# EAGLE design 612_jetracer_328_209 (EAGLE 9.6.2)
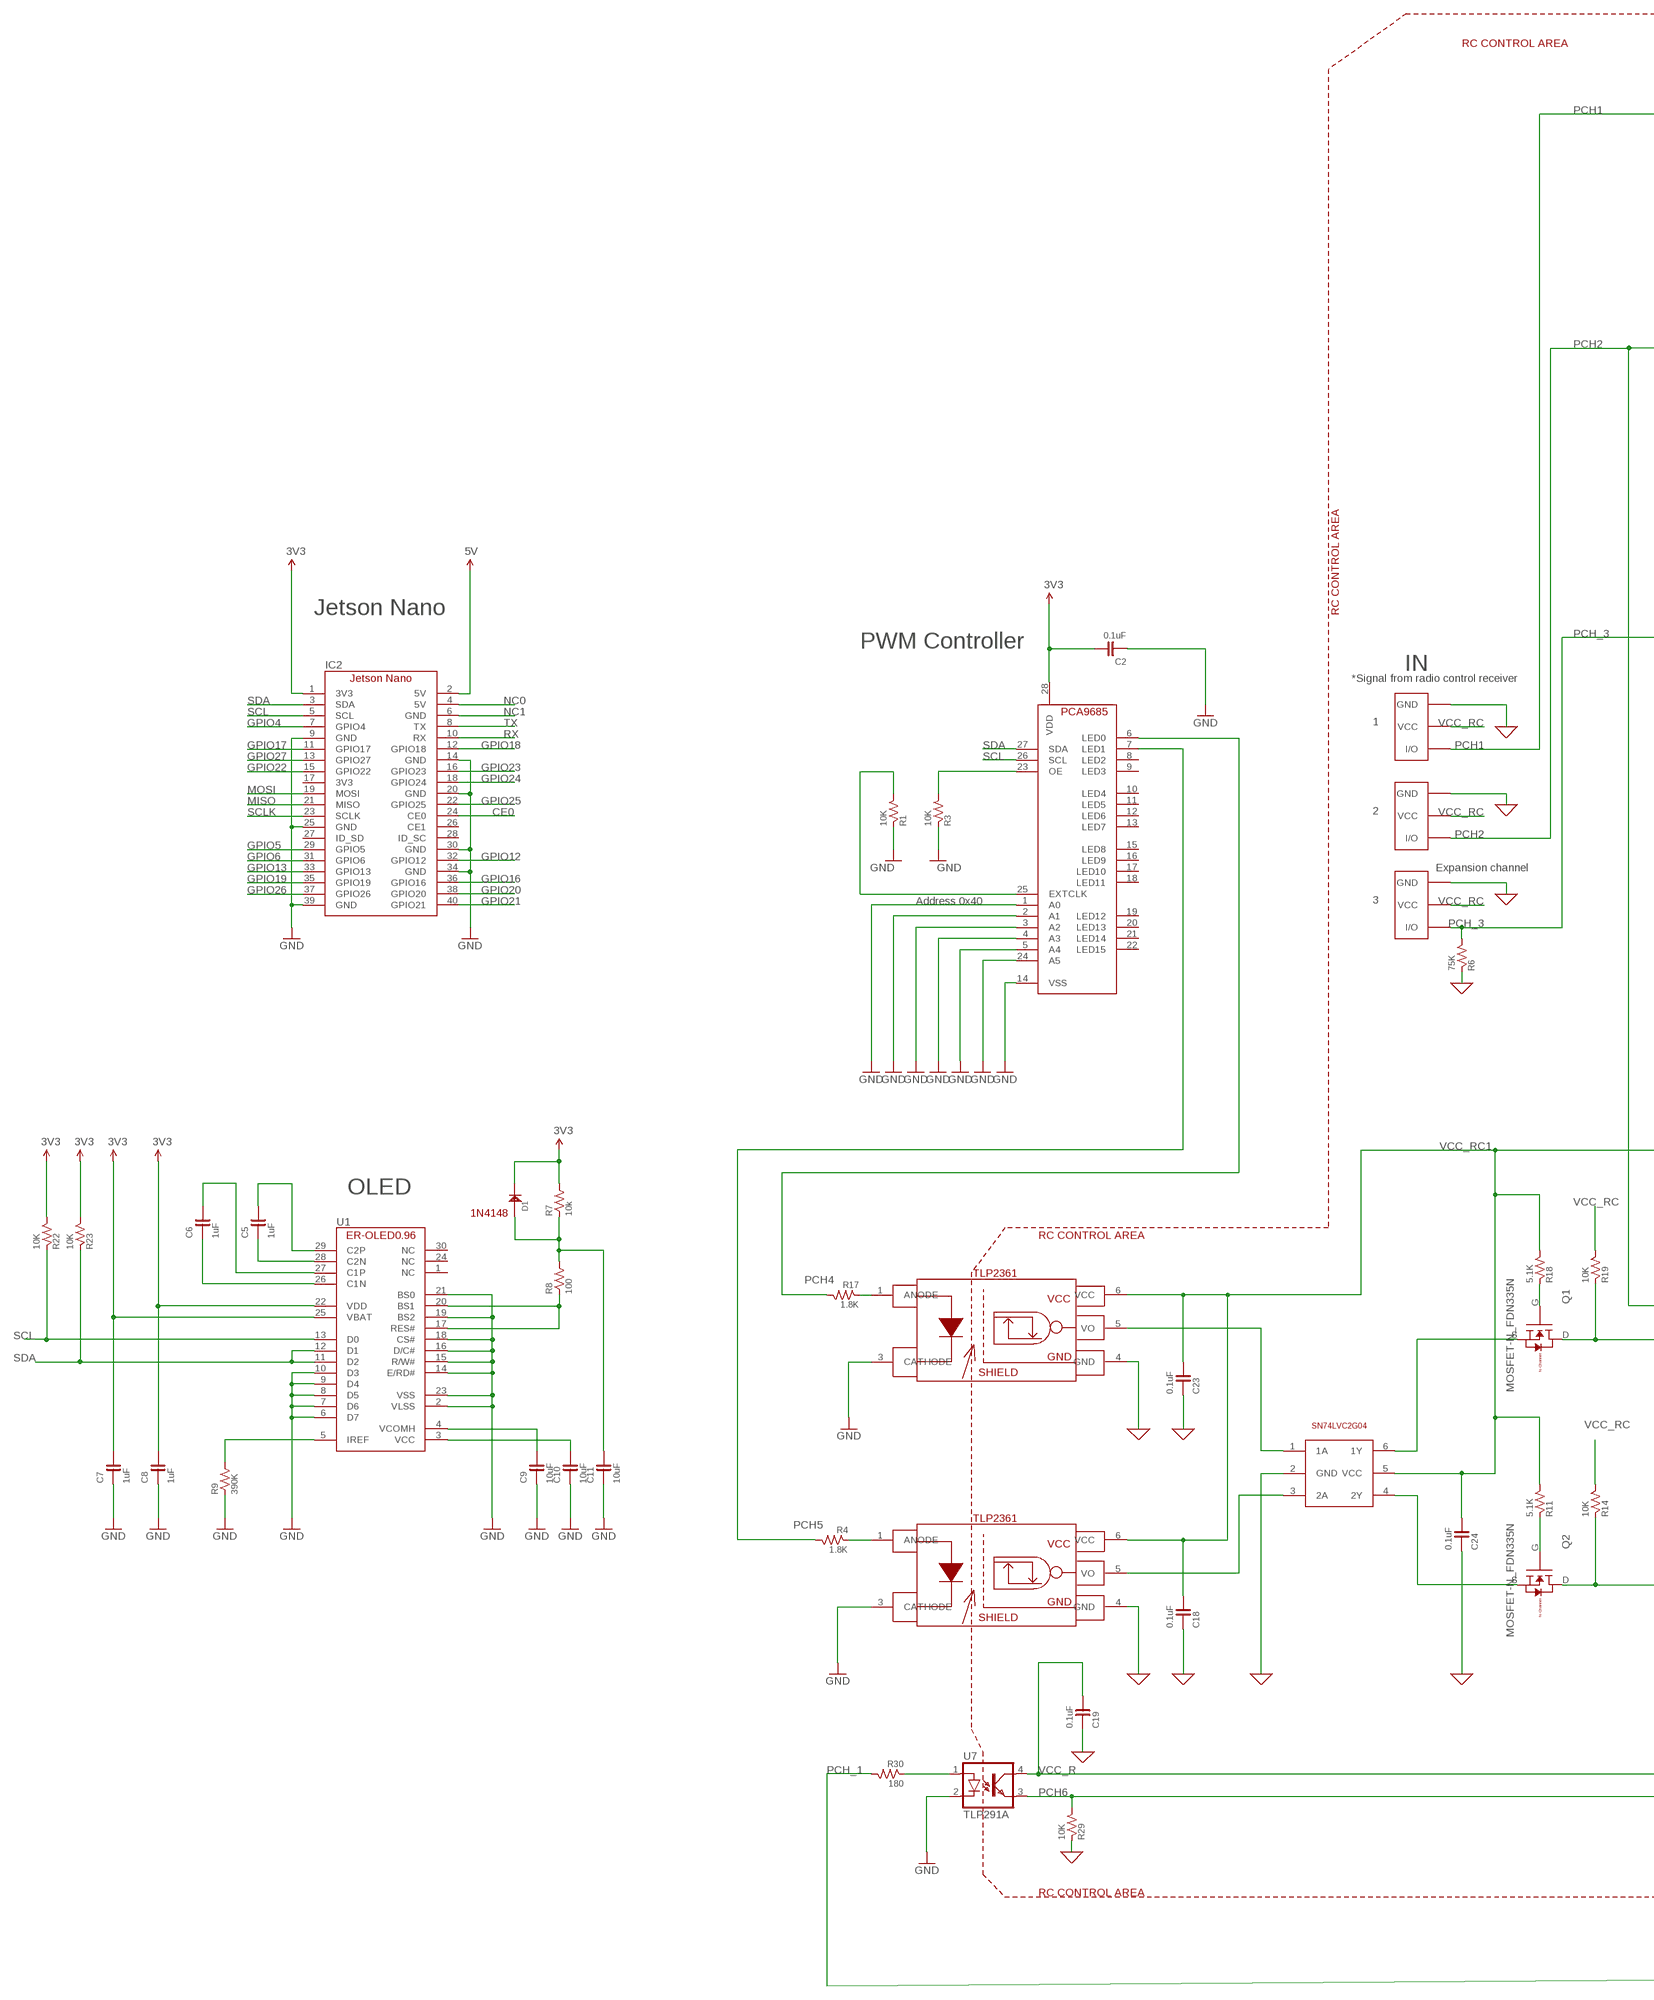
[diagram p0: schematic, sheet 1, part 1 of 3]
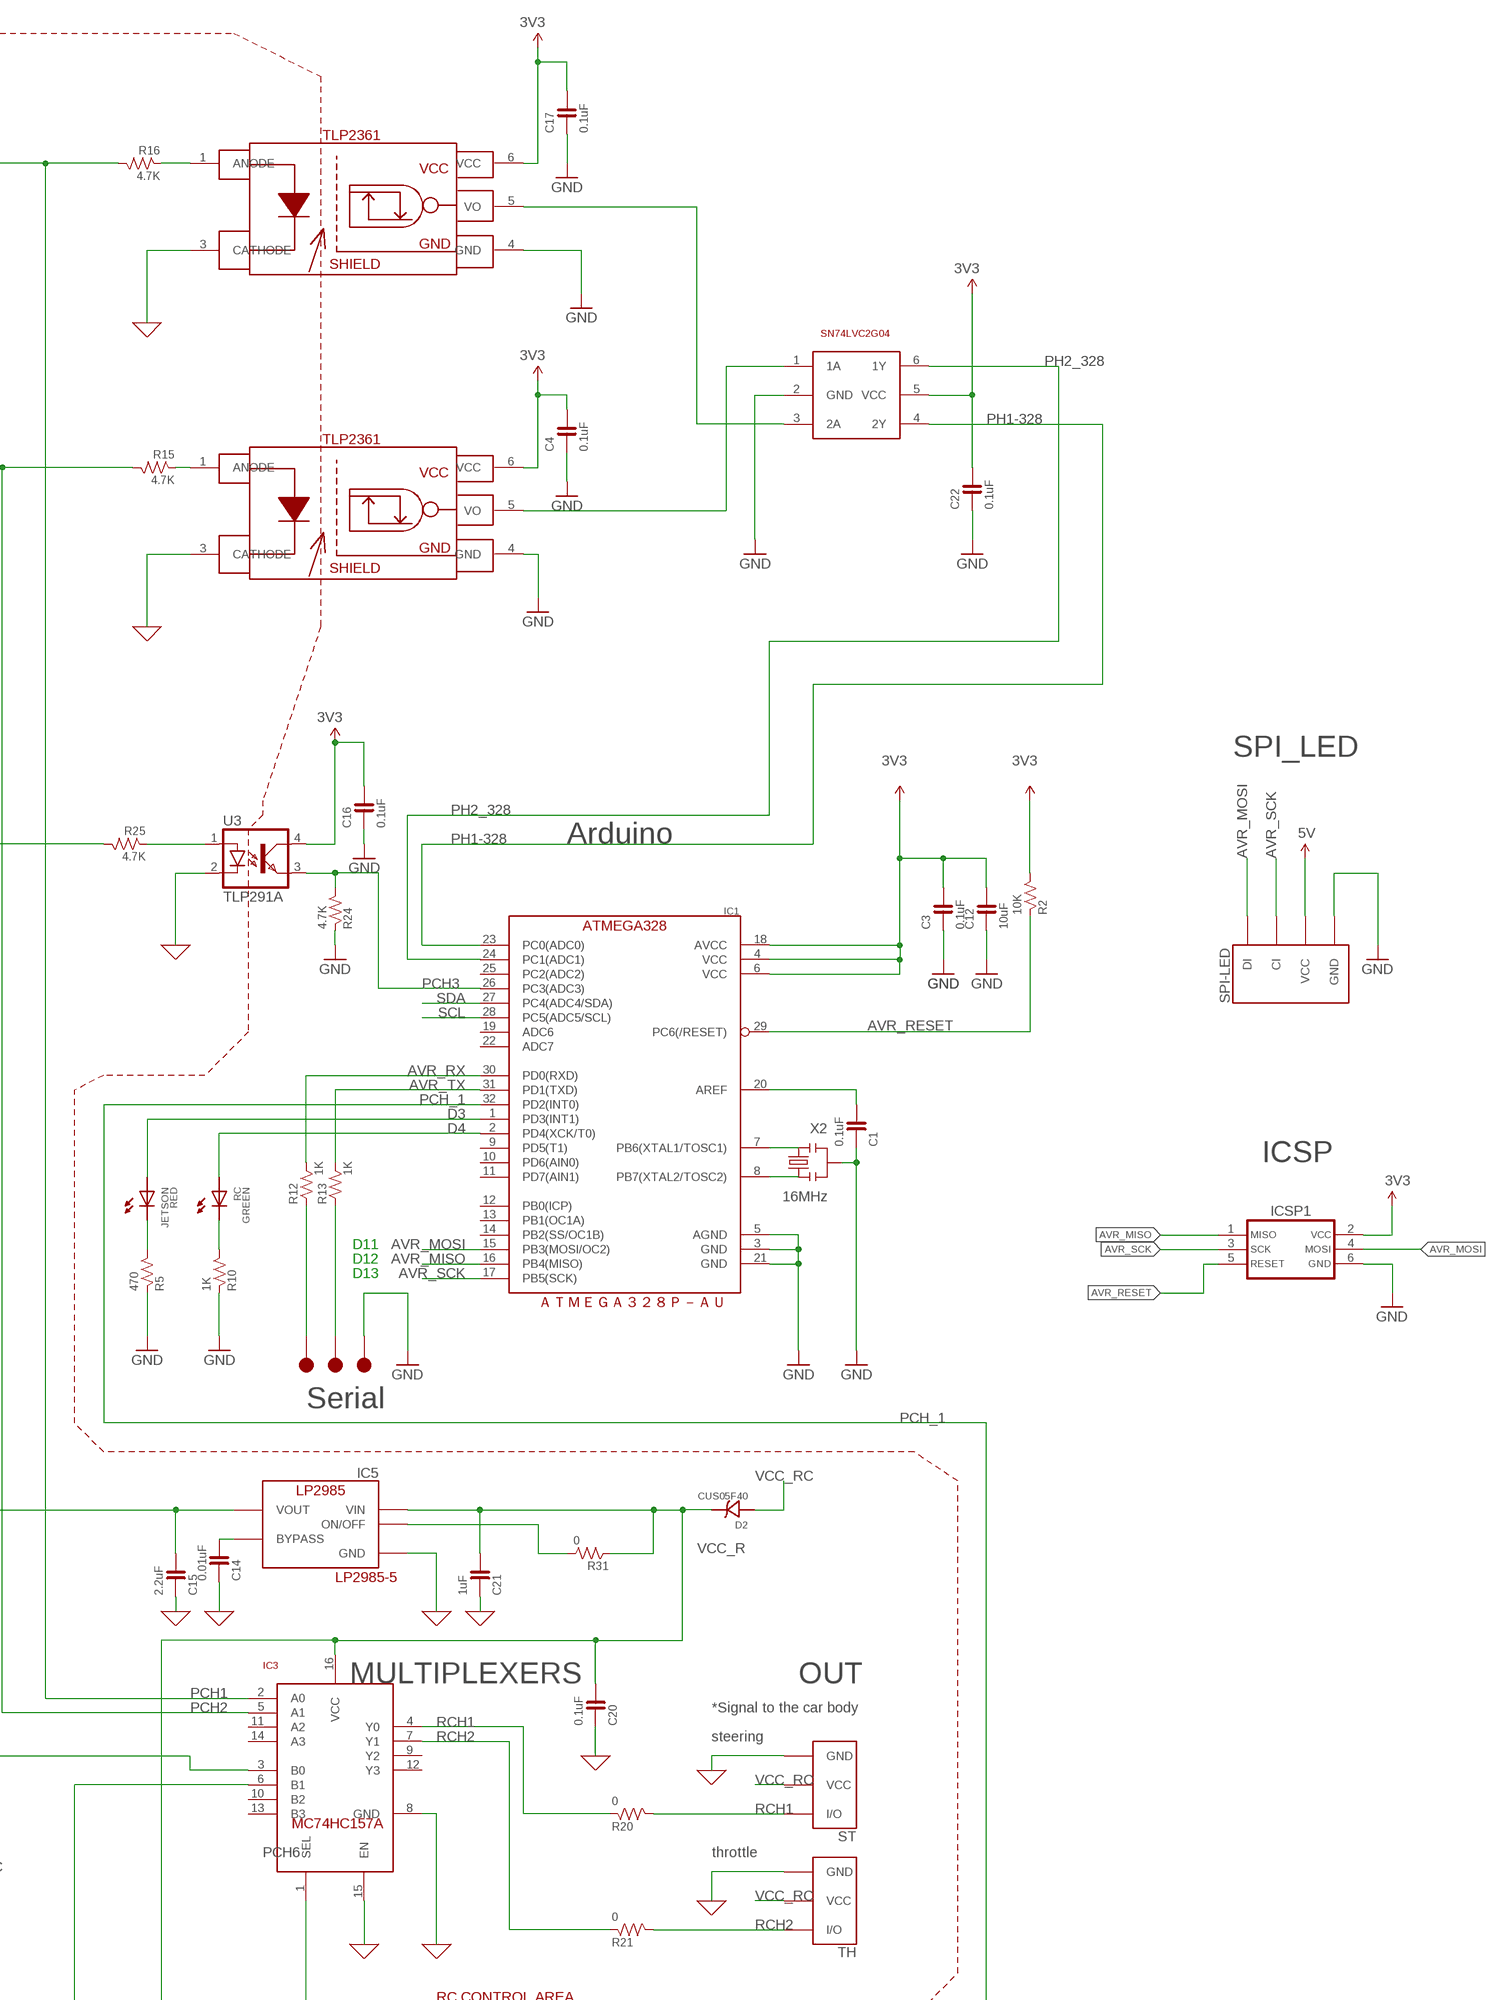
[diagram p1: schematic, sheet 1, part 2 of 3]
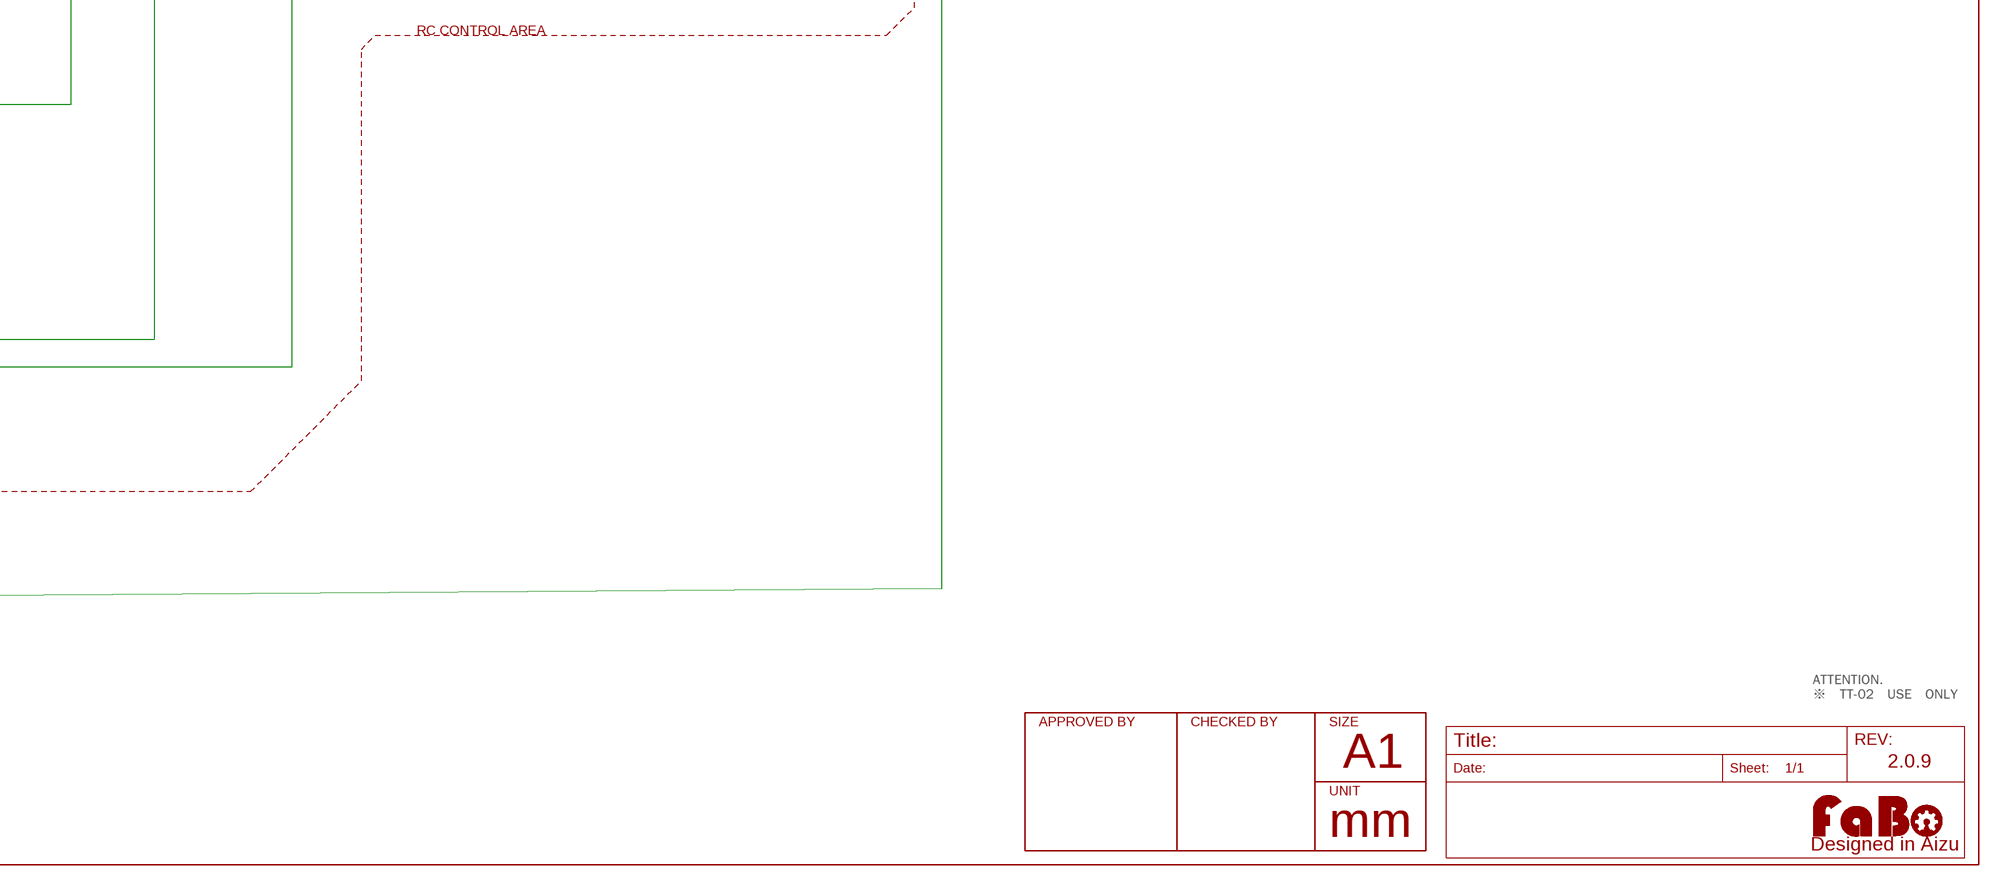
[diagram p2: schematic, sheet 1, part 3 of 3]

## Parts
1  FABO_BRICK_3PIN-HEADER  [FABO_BRICK_3PIN_HEADER]
2  FABO_BRICK_3PIN-HEADER  [FABO_BRICK_3PIN_HEADER]
3  FABO_BRICK_3PIN-HEADER  [FABO_BRICK_3PIN_HEADER]
C1  0.1uF  CAPACITOR-0603  [0603]
C2  0.1uF  CAPACITOR-0603  [0603]
C3  0.1uF  CAPACITOR-0603-BOTTOM  [0603-BOTTOM]
C4  0.1uF  CAPACITOR-0603-BOTTOM  [0603-BOTTOM]
C5  1uF  CAPACITOR-0603-BOTTOM  [0603-BOTTOM]
C6  1uF  CAPACITOR-0603-BOTTOM  [0603-BOTTOM]
C7  1uF  CAPACITOR-0603-BOTTOM  [0603-BOTTOM]
C8  1uF  CAPACITOR-0603-BOTTOM  [0603-BOTTOM]
C9  10uF  CAPACITOR-0603-BOTTOM  [0603-BOTTOM]
C10  10uF  CAPACITOR-0603-BOTTOM  [0603-BOTTOM]
C11  10uF  CAPACITOR-0603-BOTTOM  [0603-BOTTOM]
C12  10uF  CAPACITOR-0603-BOTTOM  [0603-BOTTOM]
C14  0.01uF  CAPACITOR-0603  [0603]
C15  2.2uF  CAPACITOR-0603  [0603]
C16  0.1uF  CAPACITOR-0603-BOTTOM  [0603-BOTTOM]
C17  0.1uF  CAPACITOR-0603_NARROW  [0603-NARROW]
C18  0.1uF  CAPACITOR-0603  [0603]
C19  0.1uF  CAPACITOR-0603  [0603]
C20  0.1uF  CAPACITOR-0603  [0603]
C21  1uF  CAPACITOR-0603  [0603]
C22  0.1uF  CAPACITOR-0603-BOTTOM  [0603-BOTTOM]
C23  0.1uF  CAPACITOR-0603  [0603]
C24  0.1uF  CAPACITOR-0603  [0603]
D1  1N4148  [1N4148W]
D2  CUS05F40  [CUS05F40]
IC1  ATMEGA328P-AU  [TQFP-32]
IC2  JETSON_NANO_NOBORDER  [JETSON_NANO_NOBOARDER]
IC3  MULTIPLEXERSMC74HC157A  [TSSOP-16]
IC4  PCA9685_BOTTOM  [PCA9685_BOTTOM]
IC5  LP2985-33DBV  [SOT-23-5]
ICSP1  ICSP_AVR-TC_NOHOLE  [TC2030]
JETSON  GREEN  LED-0603  [0603]
Q1  MOSFET-N_FDN335N  [SUPERSOT-3]
Q2  MOSFET-N_FDN335N  [SUPERSOT-3]
R1  10K  RESISTOR-0603  [0603]
R2  10K  RESISTOR-0603  [0603]
R3  10K  RESISTOR-0603  [0603]
R4  1.8K  RESISTOR-0603  [0603]
R5  470  RESISTOR-0603  [0603]
R6  75K  RESISTOR-0603  [0603]
R7  10k  RESISTOR-0603-BOTTOM  [0603-BOTTOM]
R8  100  RESISTOR-0603-BOTTOM  [0603-BOTTOM]
R9  390K  RESISTOR-0603-BOTTOM  [0603-BOTTOM]
R10  1K  RESISTOR-0603  [0603]
R11  5.1K  RESISTOR-0603  [0603]
R12  1K  RESISTOR-0603  [0603]
R13  1K  RESISTOR-0603  [0603]
R14  10K  RESISTOR-0603  [0603]
R15  4.7K  RESISTOR-0603  [0603]
R16  4.7K  RESISTOR-0603  [0603]
R17  1.8K  RESISTOR-0603  [0603]
R18  5.1K  RESISTOR-0603  [0603]
R19  10K  RESISTOR-0603  [0603]
R20  0  RESISTOR-0603  [0603]
R21  0  RESISTOR-0603  [0603]
R22  10K  RESISTOR-0603  [0603]
R23  10K  RESISTOR-0603  [0603]
R24  4.7K  RESISTOR-0603  [0603]
R25  4.7K  RESISTOR-0603  [0603]
R29  10K  RESISTOR-0603  [0603]
R30  180  RESISTOR-0603  [0603]
R31  0  RESISTOR-0603  [0603]
RC  RED  LED-0603  [0603]
SPI-LED  FABO-SPI-LED-B04B  [SPI-B04B-PASK-1]
ST  FABO_BRICK_3PIN-HEADER  [FABO_BRICK_3PIN_HEADER]
T5  SN74LVC2G04  [SOT-23-6]
T6  SN74LVC2G04  [SOT-23-6]
TH  FABO_BRICK_3PIN-HEADER  [FABO_BRICK_3PIN_HEADER]
TP1  TP-15  [TP-15]
TP2  TP-15  [TP-15]
TP3  TP-15  [TP-15]
U1  ER-OLED0.96-1ER-CON30HT-1  [ER-CON30HT-1]
U3  TLP291A  [11-3C1]
U7  TLP291A  [11-3C1]
U8  TLP2361  [TLP2361]
U9  TLP2361  [TLP2361]
U10  TLP2361  [TLP2361]
U11  TLP2361  [TLP2361]
U$5  LOGO_FABO-M  [LOGO_FABO_MS]
X2  16MHz  RESONATOR  [CSTNE_V_C]

## Nets
0: 1.GND 2.GND 3.GND C14.1 C15.1 C18.1 C19.1 C20.1 C21.1 C23.1 C24.1 IC3.8(GND) IC3.15(EN) IC5.2(GND) R6.1 R29.1 ST.GND T6.2(GND) TH.GND U3.2(C) U8.3(CATHODE) U9.3(CATHODE) U10.4(GND) U11.4(GND) ; supply symbol labelled GND
3V3: C2.2 C3.2 C4.2 C7.2 C8.2 C12.2 C16.2 C17.2 C22.2 D1.CATHODE IC1.4(VCC) IC1.6(VCC) IC1.18(AVCC) IC2.1(3V3) IC4.28(VDD) ICSP1.2 R2.2 R7.2 R22.2 R23.2 T5.5(VCC) U1.22(VDD) U1.25(VBAT) U3.4(COL) U8.6(VCC) U9.6(VCC)
5V: IC2.2(5V) SPI-LED.VCC
AVR_MISO: IC1.16(PB4(MISO)) ICSP1.1
AVR_MOSI: IC1.15(PB3(MOSI/OC2)) ICSP1.4 SPI-LED.DI
AVR_RESET: IC1.29(PC6(/RESET)) ICSP1.5 R2.1
AVR_RX: IC1.30(PD0(RXD)) R12.2
AVR_SCK: IC1.17(PB5(SCK)) ICSP1.3 SPI-LED.CI
AVR_TX: IC1.31(PD1(TXD)) R13.2
CE0: IC2.24(CE0)
D3: IC1.1(PD3(INT1)) RC.ANODE
D4: IC1.2(PD4(XCK/T0)) JETSON.ANODE
GND: C1.1 C2.1 C3.1 C4.1 C7.1 C8.1 C9.1 C10.1 C11.1 C12.1 C16.1 C17.1 C22.1 IC1.3(GND) IC1.5(AGND) IC1.21(GND) IC2.9(GND) IC2.14(GND) IC2.20(GND) IC2.25(GND) IC2.30(GND) IC2.34(GND) IC2.39(GND) IC4.1(A0) IC4.2(A1) IC4.3(A2) IC4.4(A3) IC4.5(A4) IC4.14(VSS) IC4.24(A5) ICSP1.6 R1.1 R3.1 R5.1 R9.1 R10.1 R24.1 SPI-LED.GND T5.2(GND) TP3.1 U1.2(VLSS) U1.6(D7) U1.7(D6) U1.8(D5) U1.9(D4) U1.10(D3) U1.14(E/RD#) U1.15(R/W#) U1.16(D/C#) U1.18(CS#) U1.19(BS2) U1.21(BS0) U1.23(VSS) U7.2(C) U8.4(GND) U9.4(GND) U10.3(CATHODE) U11.3(CATHODE) X2.2
GPIO4: IC2.7(GPIO4)
GPIO5: IC2.29(GPIO5)
GPIO6: IC2.31(GPIO6)
GPIO12: IC2.32(GPIO12)
GPIO13: IC2.33(GPIO13)
GPIO16: IC2.36(GPIO16)
GPIO17: IC2.11(GPIO17)
GPIO18: IC2.12(GPIO18)
GPIO19: IC2.35(GPIO19)
GPIO20: IC2.38(GPIO20)
GPIO21: IC2.40(GPIO21)
GPIO22: IC2.15(GPIO22)
GPIO23: IC2.16(GPIO23)
GPIO24: IC2.18(GPIO24)
GPIO25: IC2.22(GPIO25)
GPIO26: IC2.37(GPIO26)
GPIO27: IC2.13(GPIO27)
MISO: IC2.21(MISO)
MOSI: IC2.19(MOSI)
N$2: R4.1 U11.1(ANODE)
N$3: IC3.3(B0) Q1.D R19.1
N$4: C1.2 IC1.20(AREF)
N$5: IC1.8(PB7(XTAL2/TOSC2)) X2.3
N$6: R12.1 TP1.1
N$7: IC4.23(OE) R3.2
N$8: IC4.25(EXTCLK) R1.2
N$9: R15.1 U9.1(ANODE)
N$10: T5.1(1A) U9.5(VO)
N$11: T5.3(2A) U8.5(VO)
N$12: R16.1 U8.1(ANODE)
N$13: R17.1 U10.1(ANODE)
N$14: T6.1(1A) U10.5(VO)
N$15: IC1.7(PB6(XTAL1/TOSC1)) X2.1
N$16: C6.2 U1.27(C1P)
N$17: R13.1 TP2.1
N$18: T6.3(2A) U11.5(VO)
N$19: R5.2 RC.CATHODE
N$20: JETSON.CATHODE R10.2
N$21: C6.1 U1.26(C1N)
N$22: C5.1 U1.28(C2N)
N$23: C5.2 U1.29(C2P)
N$24: R9.2 U1.5(IREF)
N$25: C9.2 U1.4(VCOMH)
N$26: C10.2 U1.3(VCC)
N$27: R8.1 U1.17(RES#) U1.20(BS1)
N$28: C11.2 D1.ANODE R7.1 R8.2
N$31: C14.2 IC5.4(BYPASS)
N$32: IC5.3(ON/OFF) R31.2
N$34: Q2.S T6.4(2Y)
N$35: R21.2 TH.I/O
N$36: R20.2 ST.I/O
N$37: Q1.S T6.6(1Y)
N$38: R25.1 U3.1(A)
N$39: Q2.G R11.1
N$40: Q1.G R18.1
N$42: IC3.6(B1) Q2.D R14.1
N$43: R30.1 U7.1(A)
NC0: IC2.4(5V)
NC1: IC2.6(GND)
PCH1: 1.I/O IC3.2(A0) R16.2
PCH2: 2.I/O IC3.5(A1) R15.2
PCH3: IC1.26(PC3(ADC3)) R24.2 U3.3(EMI)
PCH4: IC4.6(LED0) R17.2
PCH5: IC4.7(LED1) R4.2
PCH6: IC3.1(SEL) R29.2 U7.3(EMI)
PCH_1: IC1.32(PD2(INT0)) R30.2
PCH_3: 3.I/O R6.2 R25.2
PH1-328: IC1.23(PC0(ADC0)) T5.4(2Y)
PH2_328: IC1.24(PC1(ADC1)) T5.6(1Y)
RCH1: IC3.4(Y0) R20.1
RCH2: IC3.7(Y1) R21.1
RX: IC2.10(RX)
SCL: IC1.28(PC5(ADC5/SCL)) IC2.5(SCL) IC4.26(SCL) R22.1 U1.13(D0)
SCLK: IC2.23(SCLK)
SDA: IC1.27(PC4(ADC4/SDA)) IC2.3(SDA) IC4.27(SDA) R23.1 U1.11(D2) U1.12(D1)
TX: IC2.8(TX)
VCC_R: C19.2 C20.2 C21.2 D2.C(CATHODE) IC3.16(VCC) IC5.1(VIN) R31.1 U7.4(COL)
VCC_RC: 1.VCC 2.VCC 3.VCC D2.A(ANODE) R14.2 R19.2 ST.VCC TH.VCC
VCC_RC1: C15.2 C18.2 C23.2 C24.2 IC5.5(VOUT) R11.2 R18.2 T6.5(VCC) U10.6(VCC) U11.6(VCC)
Unconnected: IC1.9(PD5(T1)) IC1.10(PD6(AIN0)) IC1.11(PD7(AIN1)) IC1.12(PB0(ICP)) IC1.13(PB1(OC1A)) IC1.14(PB2(SS/OC1B)) IC1.19(ADC6) IC1.22(ADC7) IC1.25(PC2(ADC2)) IC2.17(3V3) IC2.26(CE1) IC2.27(ID_SD) IC2.28(ID_SC) IC3.9(Y2) IC3.10(B2) IC3.11(A2) IC3.12(Y3) IC3.13(B3) IC3.14(A3) IC4.8(LED2) IC4.9(LED3) IC4.10(LED4) IC4.11(LED5) IC4.12(LED6) IC4.13(LED7) IC4.15(LED8) IC4.16(LED9) IC4.17(LED10) IC4.18(LED11) IC4.19(LED12) IC4.20(LED13) IC4.21(LED14) IC4.22(LED15) U1.1(NC) U1.24(NC) U1.30(NC)

## Notes on the sheet
- RC CONTROL AREA
- SPI_LED
- Jetson Nano | RC CONTROL AREA
- Arduino
- PWM Controller
- IN
- *Signal from radio control receiver
- Expansion channel
- ICSP
- Address 0x40
- D11
- D12
- D13
- ＡＴＭＥＧＡ３２８Ｐ－ＡＵ
- Serial
- OLED
- LP2985-5
- 1N4148
- RC CONTROL AREA
- MULTIPLEXERS | OUT
- *Signal to the car body
- steering
- MC74HC157A
- throttle
- RC CONTROL AREA
- RC CONTROL AREA
- ATTENTION.
  ※　TT-02　USE　ONLY
- 2.0.9

## Library data of the parts
1-3 ST TH = FaBo-Template:FABO_BRICK_3PIN: FaBo Brick 3pin
C1-C12 C14-C17 C20-C22 = FaBo-Capacitor:CAPACITOR: CAPACITOR
C18 C19 C23 C24 = FaBo-Capacitor:CAPACITOR: CAPACITOR; SPICEPREFIX: C
D1 = FaBo-Diode:1N4148
D2 = FaBo-Diode:CUS05F40
IC1 = component:ATMEGA328
IC2 = FaBo-Boards:JETSON_NANO
IC3 = FaBo-Multiplexers:MULTIPLEXERS
IC4 = FaBo-Motor:PCA9685
IC5 = FaBo-Supply:LP2985: LP2985
ICSP1 = component:ICSP_AVR
JETSON RC = FaBo-LED:LED
Q1 Q2 = FaBo-Mosfet:MOSFET-N
R1-R25 R29-R31 = FaBo-Resistors:RESISTOR: RESISTOR
SPI-LED = FaBo-Connetor:FABO-SPI-LED
T5 T6 = FaBo-Transistor:SN74LVC2G04
TP1-TP3 = FaBo-Supply:TP
U1 = FaBo-Display:ER-OLED0.96-1
U3 U7 = FaBo_Photocoupler:TLP291A
U8-U11 = FaBo-etc:TLP2361
U$5 = FaBo-Logo:LOGO_FABO
X2 = component:RESONATOR

## Board
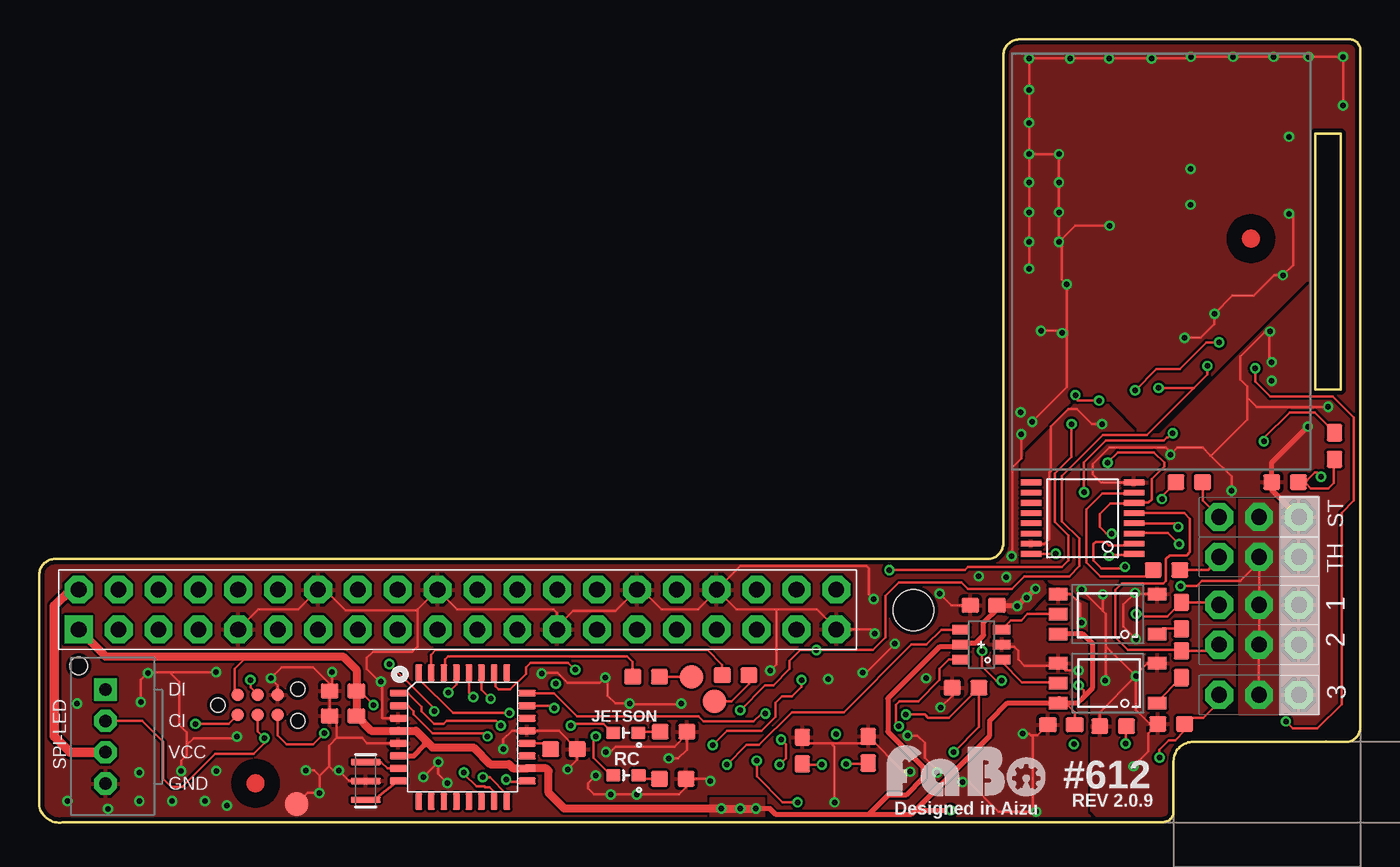
[diagram p3: board, top side]
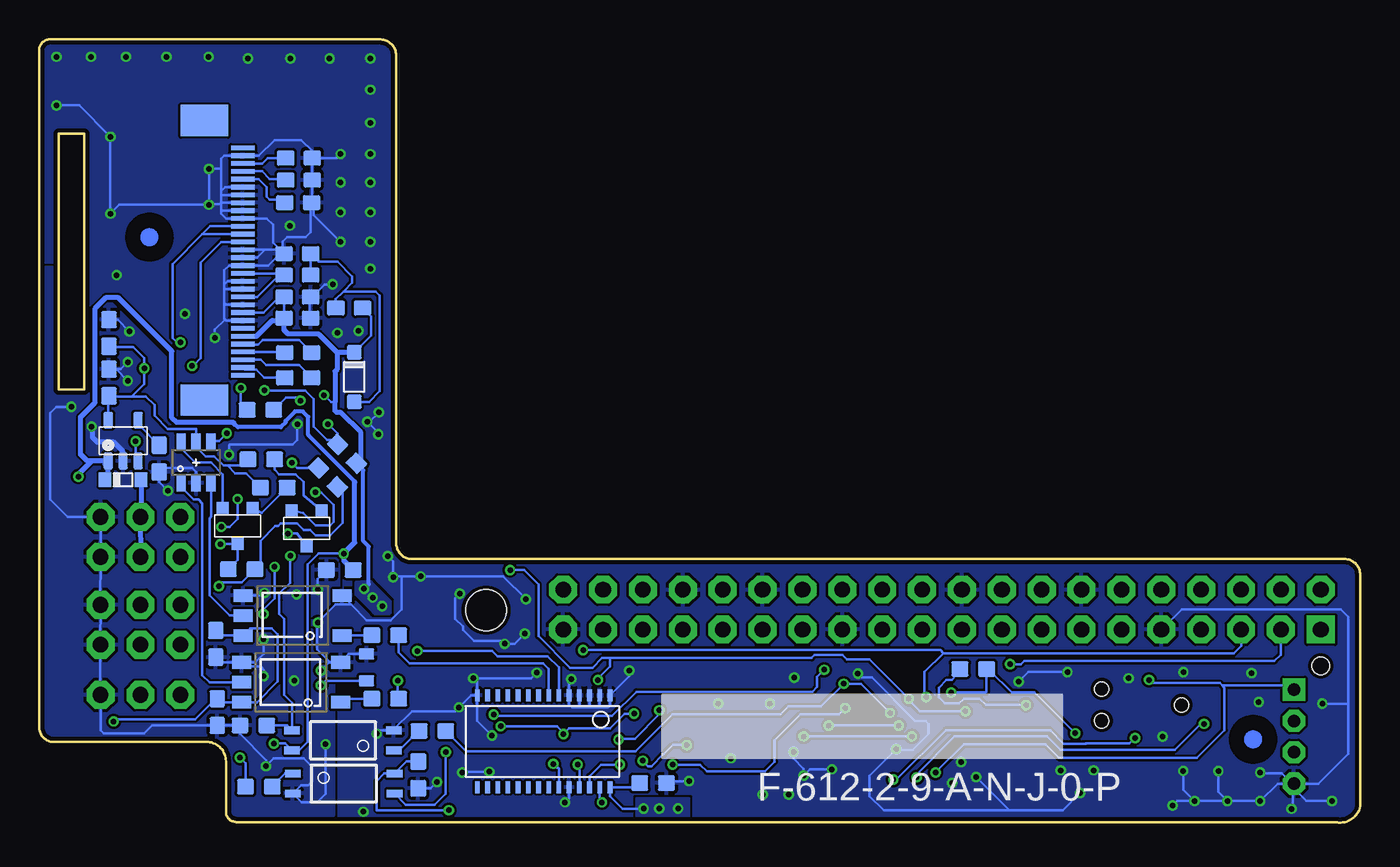
[diagram p4: board, bottom side, seen from below]

Size 84.14 x 49.91 mm. Coordinates in mm from the lower left corner, seen from the top.
Outline: 61.4,48.8 61.4,17.79 arc-90 60.4,16.79 1,16.79 arc90 0,15.79 0,1.03 arc90 1.6,0.03 71.55,0.03 arc90 72.25,0.69 72.25,3.79 arc-90 73.39,5.14 83.15,5.14 arc90 84.14,6.01 84.14,49.3 arc90 83.34,49.9 62.4,49.9 arc90 61.4,48.8
Outline: 82.92,27.6 82.92,43.88 81.28,43.88 81.28,27.6 82.92,27.6
Copper layers (1*16): Top 0.035mm / dielectric 1.6mm / Bottom 0.035mm
Design rules "PCBway": minimum track width 6mil, minimum drill 12mil, track to track 6mil, track to pad 6mil, pad to pad 6mil, via to via 6mil, smd to smd 6mil, copper to edge 10mil, drill to drill 10mil, minimum pad ring 10mil, minimum via ring 6mil, stop-mask expansion 2mil, vias tented up to drill 100mil, thermal gap 8mil
Holes 2.6 mm at 55.68,13.54
bRestrict: 11 lines

### Footprints (pad centres in the part's own frame; a part is rotated, then mirrored left to right if it is on the bottom)
FABO_BRICK_3PIN_HEADER = drill 1 pad 1.778 octagon: GND -2.54,0; I/O 2.54,0; VCC 0,0
0603 = smd 1.1 x 1: 1 -0.85,0; 2 0.85,0
0603-BOTTOM = smd 1.1 x 1 bottom: 1 -0.85,0; 2 0.85,0
0603-NARROW = smd 0.71 x 1: 1 -0.85,0; 2 0.85,0
1N4148W = smd 0.9 x 0.95: ANODE 0,0; CATHODE 3.15,0
CUS05F40 = smd 0.8 x 0.9: A -1.15,0; C 1.15,0
TQFP-32 = smd 1.1 x 0.45: 1 -4.1,2.8; 2 -4.1,2; 3 -4.1,1.2; 4 -4.1,0.4; 5 -4.1,-0.4; 6 -4.1,-1.2; 7 -4.1,-2; 8 -4.1,-2.8; 17 4.1,-2.8; 18 4.1,-2; 19 4.1,-1.2; 20 4.1,-0.4; 21 4.1,0.4; 22 4.1,1.2; 23 4.1,2; 24 4.1,2.8 | smd 0.45 x 1.1: 9 -2.8,-4.1; 10 -2,-4.1; 11 -1.2,-4.1; 12 -0.4,-4.1; 13 0.4,-4.1; 14 1.2,-4.1; 15 2,-4.1; 16 2.8,-4.1; 25 2.8,4.1; 26 2,4.1; 27 1.2,4.1; 28 0.4,4.1; 29 -0.4,4.1; 30 -1.2,4.1; 31 -2,4.1; 32 -2.8,4.1
JETSON_NANO_NOBOARDER = drill 1 pad 1.778 square: 1 1.27,1.27 | drill 1 pad 1.778 octagon: 2 1.27,3.81; 3 3.81,1.27; 4 3.81,3.81; 5 6.35,1.27; 6 6.35,3.81; 7 8.89,1.27; 8 8.89,3.81; 9 11.43,1.27; 10 11.43,3.81; 11 13.97,1.27; 12 13.97,3.81; 13 16.51,1.27; 14 16.51,3.81; 15 19.05,1.27; 16 19.05,3.81; 17 21.59,1.27; 18 21.59,3.81; 19 24.13,1.27; 20 24.13,3.81; 21 26.67,1.27; 22 26.67,3.81; 23 29.21,1.27; 24 29.21,3.81; 25 31.75,1.27; 26 31.75,3.81; 27 34.29,1.27; 28 34.29,3.81; 29 36.83,1.27; 30 36.83,3.81; 31 39.37,1.27; 32 39.37,3.81; 33 41.91,1.27; 34 41.91,3.81; 35 44.45,1.27; 36 44.45,3.81; 37 46.99,1.27; 38 46.99,3.81; 39 49.53,1.27; 40 49.53,3.81
TSSOP-16 = smd 0.36 x 1.3: 1 -2.275,-3.28; 2 -1.625,-3.28; 3 -0.975,-3.28; 4 -0.325,-3.28; 5 0.325,-3.28; 6 0.975,-3.28; 7 1.625,-3.28; 8 2.275,-3.28; 9 2.275,3.28; 10 1.625,3.28; 11 0.975,3.28; 12 0.325,3.28; 13 -0.325,3.28; 14 -0.975,3.28; 15 -1.625,3.28; 16 -2.275,3.28
PCA9685_BOTTOM = smd 0.3 x 0.75 bottom: 1 4.3,-2.93; 2 3.65,-2.93; 3 3,-2.93; 4 2.35,-2.93; 5 1.7,-2.93; 6 1.05,-2.93; 7 0.4,-2.93; 8 -0.25,-2.93; 9 -0.9,-2.93; 10 -1.55,-2.93; 11 -2.2,-2.93; 12 -2.85,-2.93; 13 -3.5,-2.93; 14 -4.15,-2.93; 15 -4.15,2.92; 16 -3.5,2.92; 17 -2.85,2.92; 18 -2.2,2.92; 19 -1.55,2.92; 20 -0.9,2.92; 21 -0.25,2.92; 22 0.4,2.92; 23 1.05,2.92; 24 1.7,2.92; 25 2.35,2.92; 26 3,2.92; 27 3.65,2.92; 28 4.3,2.92
SOT-23-5 = smd 0.6 x 1.05: 1 -0.95,-1.3; 2 0,-1.3; 3 0.95,-1.3; 4 0.95,1.3; 5 -0.95,1.3
TC2030 = smd 0.787 x 0.787: 1 1.27,-0.635; 2 1.27,0.635; 3 2.54,-0.635; 4 2.54,0.635; 5 3.81,-0.635; 6 3.81,0.635 | hole 0.889: 0,0; 5.08,-1.016; 5.08,1.016
0603' = smd 0.9 x 0.8: ANODE -0.8,0; CATHODE 0.8,0
SUPERSOT-3 = smd 0.76 x 0.76: D 0,1.15; G -0.95,-1.15; S 0.95,-1.15
SPI-B04B-PASK-1 = drill 0.8 pad 1.422 octagon: CI 1,1.27; GND -3,1.27; VCC -1,1.27 | drill 0.8 pad 1.422 square: DI 3,1.27 | hole 1.1: 4.5,2.97
SOT-23-6 = smd 0.6 x 1.1: 1 -0.95,-1.3; 2 0,-1.3; 3 0.95,-1.3; 4 0.95,1.3; 5 0,1.3; 6 -0.95,1.3
TP-15 = smd 1.5 x 1.5: 1 0,0
ER-CON30HT-1 = smd 0.3 x 1.5 bottom: 1 7,-0.23; 2 6.5,-0.23; 3 6,-0.23; 4 5.5,-0.23; 5 5,-0.23; 6 4.5,-0.23; 7 4,-0.23; 8 3.5,-0.23; 9 3,-0.23; 10 2.5,-0.23; 11 2,-0.23; 12 1.5,-0.23; 13 1,-0.23; 14 0.5,-0.23; 15 0,-0.23; 16 -0.5,-0.23; 17 -1,-0.23; 18 -1.5,-0.23; 19 -2,-0.23; 20 -2.5,-0.23; 21 -3,-0.23; 22 -3.5,-0.23; 23 -4,-0.23; 24 -4.5,-0.23; 25 -5,-0.23; 26 -5.5,-0.23; 27 -6,-0.23; 28 -6.5,-0.23; 29 -7,-0.23; 30 -7.5,-0.23 | smd 2 x 3 bottom: 31 -9.07,-2.67; 32 8.74,-2.67
11-3C1 = smd 1 x 0.5: 1 -3.24,0.635; 2 -3.24,-0.635; 3 3.24,-0.635; 4 3.24,0.635
TLP2361 = smd 0.8 x 1.2: 1 -1.27,-3.15; 3 1.27,-3.15; 4 1.27,3.15; 5 0,3.15; 6 -1.27,3.15
CSTNE_V_C = smd 0.4 x 1.9: 1 1.2,0; 2 0,0; 3 -1.2,0

### Placement (x,y rotation side)
1  77.7,13.88 180 top
2  77.7,11.34 180 top
3  77.7,8.14 180 top
C1  33.42,4.68 180 top
C2  45.05,2.52 180 bottom
C3  19.35,6.79 180 bottom
C4  65.1,6.24 180 bottom
C5  67.65,28.34 0 top
C6  67.65,29.94 0 top
C7  67.7,32.14 0 top
C8  67.7,33.49 0 top
C9  67.6,40.94 0 top
C10  67.6,42.34 0 top
C11  67.7,36.24 180 top
C12  19.35,8.39 180 bottom
C14  76.5,23.19 90 bottom
C15  79.7,28.04 270 bottom
C16  60,3.04 90 top
C17  63.3,9.89 270 bottom
C18  72.8,7.04 90 bottom
C19  68.4,6.14 0 top
C20  65,16.09 0 bottom
C21  79.35,21.69 0 top
C22  60.15,13.84 180 bottom
C23  72.9,11.39 90 bottom
C24  79.7,31.19 270 bottom
D1  64.08,26.81 90 bottom
D2  78.8,21.84 180 bottom
IC1  26.97,5.45 0 top
IC2  1.24,11.03 0 top
IC3  66.45,19.39 90 top
IC4  52.09,5.17 180 top
IC5  78.8,24.34 0 bottom
ICSP1  11.38,7.5 0 top
JETSON  GREEN  [0603']  37.37,3 0 top
Q1  71.5,18.89 180 bottom
Q2  67.1,18.74 180 bottom
R1  48.6,4.59 270 top
R2  24.65,9.79 180 bottom
R3  52.8,4.64 270 top
R4  62.1,11.94 0 bottom
R5  40.4,5.79 180 top
R6  72.1,6.29 0 top
R7  64.4,32.79 180 top
R8  67.7,34.89 180 top
R9  67.65,39.49 0 top
R10  40.35,2.79 180 top
R11  70,23.14 180 bottom
R12  38.65,9.29 180 top
R13  44.35,9.39 180 top
R14  65.75,21.99 315 bottom
R15  72.75,10.09 90 top
R16  72.75,13.19 90 top
R17  62.1,7.89 0 bottom
R18  69.2,21.34 180 bottom
R19  71.25,16.14 0 bottom
R20  73.25,21.69 0 top
R21  71.8,16.09 0 top
R22  70.05,26.29 0 bottom
R23  64.53,23.5 315 bottom
R24  59,8.59 0 top
R25  70.15,2.29 180 bottom
R29  70.5,6.19 0 bottom
R30  59.1,5.84 0 bottom
R31  82.5,23.99 90 top
RC  RED  [0603']  37.36,5.73 0 top
SPI-LED  5.49,5.48 90 top
ST  77.7,19.47 180 top
T5  60,11.34 90 top
T6  74.15,22.94 0 bottom
TH  77.7,16.93 180 top
TP1  41.55,9.29 0 top
TP2  43.01,7.74 0 top
TP3  16.39,1.19 0 top
U1  70.95,35.99 90 top
U3  64.75,2.49 0 bottom
U7  64.8,5.24 180 bottom
U8  68.05,13.29 90 top
U9  68.05,8.89 90 top
U10  68.1,8.94 90 bottom
U11  68,13.19 90 bottom
U$1  [MARK_POINT_3MM]  77.17,37.21 0 top
U$2  [MARK_POINT_3MM]  77.12,37.3 0 bottom
U$3  [MARK_POINT_3MM]  6.82,5.31 0 bottom
U$5  59.06,1.3 0 top
U$6  [MARK_POINT_3MM]  13.78,2.51 0 top
X2  20.79,2.66 90 top

### Tracks (layer width: path | path; a pad name or v marks a point on that pad's centre or on a via)
0  (via drill 0.35)
  Top 0.152: IC3.15 64.03,17.77 64.34,18.09 64.34,22.32 64.45,22.42 64.45,25.23 65.56,26.34 66.1,26.34 67.05,25.39 v67.7,25.39 | v72.05,23.44 72.12,23.52 | 72.12,23.52 72.5,23.89 74.1,23.89 74.6,23.39 | 74.6,23.39 75.95,22.04 v75.95,21.14 | 74.6,23.39 74.65,23.39 76.95,25.69 76.95,27.09 | 69.85,9.24 v69.85,9.34 69.8,9.39 | 69.85,9.24 69.85,7.19 70.75,6.29 R6.1 70.65,5.69 70.65,4.54 v69.7,3.59 | v66.4,14.84 67.75,13.49 | 67.95,11.24 69.8,9.39 | 67.95,11.24 67.95,13.29 67.75,13.49 | C19.1 67.55,7.04 69.75,9.24 69.85,9.24 | v69.85,11.69 69.05,12.49 69.05,13.89 v69.8,14.64 69.88,14.56 U8.3 | IC3.8 67.62,21.67 67.1,22.19 67.1,22.84 68.16,23.9 71.75,23.9 72.12,23.52 | U9.3 70.57,10.16 69.8,9.39 | v67.75,14.54 67.75,13.49 | 67.95,11.24 67.95,9.09 v67.9,9.04 | 76.95,27.09 76.95,27.79 76.5,28.24 76.5,29.69 78.1,31.29 78.35,31.29 | 78.35,31.29 v78.4,31.29 | v78.5,29.34 78.35,29.49 78.35,31.29 | v82.1,26.49 77.55,26.49 76.95,27.09
  Top 0.305: ST.GND 78.5,21.2 C21.1 78.5,22.94 v80.8,25.24
  Bottom 0.152: v72.05,23.44 72.05,24.04 72,24.09 68,24.09 67.7,24.39 v67.7,25.39 | v82.1,26.49 83.05,26.49 83.45,26.09 83.45,20.59 82.33,19.47 ST.GND 80.23,16.85 TH.GND 80.26,13.99 1.GND 80.26,11.4 80.22,11.36 2.GND 3.GND 80.23,5.88 80.05,5.69 77.45,5.69 76.95,6.19 C18.1 R29.1 71.35,5.64 69.67,3.97 69.67,3.62 | 80.75,25.19 v80.8,25.24 | v75.95,21.14 76.5,21.69 C14.1 76.25,22.59 74.4,22.59 74.15,22.34 T6.2 | C23.1 72.57,10.21 U10.4 | U10.4 70.98,9.94 70.05,9.94 69.85,9.74 v69.85,9.34 | C20.1 66.4,15.54 v66.4,14.84 | U11.4 69.98,14.46 v69.8,14.64 | v69.85,11.69 69.85,10.74 70.38,10.21 U10.4 | 69.67,3.62 v69.7,3.59 | 69.67,3.62 69.2,4.09 67.3,4.09 66.75,3.54 66.75,2.64 67,2.39 67.45,2.39 U3.2 67.42,1.29 66.45,1.29 65.9,1.84 v65.9,4.99 | v78.4,31.29 79.15,32.04 C24.1 | 79.25,28.89 78.95,28.89 v78.5,29.34 | v78.5,28.14 79.25,28.89 | 79.25,28.89 C15.1
  Bottom 0.305: IC5.2 78.8,23.64 79.4,24.24 80.45,24.24 80.75,24.54 80.75,25.19
  pour Bottom (rank 2): 65.4,0.44 65.35,0.49 65.35,13.08 65.05,13.38 65.05,23.44 67.45,25.84 74.05,25.84 74.35,26.14 74.35,27.94 81.8,35.39 84.15,35.39 84.95,34.59 84.95,5.69 79.7,0.44
  pour Top (rank 2): 62.6,16.09 62.6,23.29 65.9,26.59 68.1,26.59 69.95,24.74 71.35,24.74 82.45,35.84 84.2,35.84 85.1,34.94 85.1,5.59 79.85,0.34 67.4,0.34 67,0.74 67,14.14
3V3  (via drill 0.35)
  Top 0.152: 20.2,8.29 20.49,8.29 v21.29,7.49 | ICSP1.2 12.45,8.34 12.45,9.79 13.25,10.59 14.15,10.59 | U9.6 64.9,7.97 65,7.97 65.95,7.02 C4.2 | 61.05,13.84 C22.2 | v67.5,26.89 66.15,26.89 66,27.04 v66,27.24 | v66.2,8.74 66.53,8.42 66.53,8.02
  Top 0.305: 20.2,8.29 C12.2 | 31.05,3.47 IC1.18 | v45.65,0.89 46.55,0.89 46.9,0.54 52.85,0.54 | IC1.6 23.86,4.25 24.55,4.94 24.55,5.29 | 52.85,0.54 55.55,0.54 55.8,0.79 | 55.8,0.79 v58.05,0.79 | 55.8,0.79 60.55,5.54 60.55,6.49 61.68,7.62 U9.6 66.13,7.62 66.53,8.02 67.1,8.59 67.1,11.39 66.47,12.02 U8.6 | 52.85,0.54 54.05,1.74 55.2,1.74 56.3,2.84 56.3,3.54 54.05,5.79 54.05,7.9 57.34,11.19 58.55,11.19 T5.5 58.8,11.44 59.65,11.44 60.15,11.94 60.15,12.74 61.05,13.64 61.05,13.84 | C22.2 62.25,13.84 v62.3,13.79 62.85,14.34 v62.9,14.34 v63.45,14.89
  Top 0.508: IC2.1 4.22,10.59 14.15,10.59 19.35,10.59 20.2,9.74 20.2,8.29 | C12.2 C3.2 21.14,5.85 IC1.4 23.99,5.85 24.55,5.29 25.05,4.79 27.65,4.79 28.72,3.73 29.92,3.73 30.17,3.47 31.05,3.47 | v45.65,0.89 v44.65,0.89 v43.45,0.89 33.45,0.89 32.45,1.89 32.45,3.29 32.29,3.45 IC1.18
  Bottom 0.152: R2.2 25.5,9.65 26,9.09 26.35,9.09 26.85,8.59 26.85,7.99 26.45,7.59 25.55,7.59 25.25,7.89 24.25,7.89 23.85,7.49 v21.29,7.49 | R7.2 63,32.24 63,31.04 D1.CATHODE | U1.22 69.85,32.49 68.85,33.49 C8.2 C7.2 | v45.65,0.89 47,0.89 47.79,1.68 IC4.28 46.17,2.25 C2.2 | v58.05,0.79 62.65,0.79 62.65,2.64 62.17,3.13 U3.4 60.75,3.89 C16.2 | v67.5,26.89 67.7,27.09 68.4,27.09 R22.2 | v66,27.24 65.55,26.79 65.3,26.79 | C17.2 65.9,9.04 v66.2,8.74
  Bottom 0.254: v63.45,14.89 63.15,15.19 63.15,17.59 63.5,17.94 63.5,22.46 R23.2
  Bottom 0.305: 65.17,29.96 66.35,31.14 68.3,31.14 68.55,31.39 68.55,31.99 | 68.55,31.99 C7.2 | U1.25 70.3,30.99 69.3,31.99 68.55,31.99 | R23.2 63.65,23.18 63.65,24.84 64.95,26.14 65.2,26.14 65.3,26.24 65.3,26.79 65.3,28.74 65.17,28.87 65.17,29.96 | D1.CATHODE 65.17,29.96
  pour Top (no thermals): 42.75,1.54 46.15,1.54 46.15,0.19 42.75,0.19
  pour Bottom (no thermals): 42.75,1.54 46.1,1.54 46.1,0.19 42.75,0.19
  pour Top (no thermals): 61.65,13.49 61.65,14.09 62.15,14.59 62.95,15.39 63.85,15.39 64.05,15.19 64.05,14.59 62.8,13.34 62.1,13.34 61.8,13.34
  pour Bottom (no thermals): 61.75,13.54 61.75,14.09 63,15.34 63.95,15.34 64,15.29 64,14.59 64,14.54 62.9,13.44 62.8,13.34 61.8,13.34 61.75,13.39 61.75,13.49
5V
  Top 0.61: SPI-LED.VCC 1.96,4.48 0.95,5.49 0.95,13.79 2,14.84 IC2.2
AVR_MISO  (via drill 0.35)
  Top 0.152: ICSP1.1 12.07,6.29 v9.95,6.29 | v28.25,2.89 28.7,2.89 29.77,1.82 IC1.16
  Bottom 0.152: v9.95,6.29 10.15,6.29 11.8,4.64 19.1,4.64 19.95,5.49 25.85,5.49 28.25,3.09 v28.25,2.89
AVR_MOSI  (via drill 0.35)
  Top 0.152: ICSP1.4 13.45,8.61 v13.45,9.09 | IC1.15 28.97,1.97 28.7,2.25 28.41,2.25 28.35,2.3 27.84,2.3 27.05,3.09 v27.05,3.19
  Bottom 0.152: v13.45,9.09 13.25,8.89 8.95,8.89 8.8,8.74 | 8.8,8.74 4.48,8.74 SPI-LED.DI | 8.8,8.74 8.65,8.59 8.65,5.89 10.4,4.14 19.2,4.14 20.05,4.99 25.25,4.99 v27.05,3.19
AVR_RESET  (via drill 0.35)
  Top 0.152: ICSP1.5 15.19,5.55 15.75,4.99 17.45,4.99 v18.15,5.69 | v26.05,8.29 26.57,8.81 IC1.29
  Bottom 0.152: v18.15,5.69 20.75,8.29 22.2,8.29 23.55,9.64 23.8,9.64 | v26.05,8.29 23.85,8.29 23.8,8.34 23.8,9.64 | R2.1 23.8,9.64
AVR_RX
  Top 0.152: R12.2 37.8,10.24 37.45,10.59 26.05,10.59 25.85,10.39 25.85,9.63 IC1.30
AVR_SCK  (via drill 0.35)
  Top 0.152: SPI-LED.CI 6.56,6.48 7.9,5.14 7.9,2.79 8.4,2.29 9.1,2.29 11.2,4.39 13.65,4.39 14.35,5.09 v14.35,5.39 13.92,5.82 ICSP1.3 | v29.74,2.75 29.89,2.59 31.01,2.59 IC1.17
  Bottom 0.152: v14.35,5.39 14.7,5.04 17.46,5.04 17.47,5.04 18.89,5.04 19.75,5.89 26.39,5.89 29.54,2.75 v29.74,2.75
AVR_TX
  Top 0.152: IC1.31 25.01,9.53 24.95,9.59 24.95,10.69 25.25,10.99 42.55,10.99 43.5,10.04 R13.2
D3  (via drill 0.35)
  Top 0.152: v29.4,6.19 29.1,6.49 25.95,6.49 25.75,6.29 25.15,6.29 24.35,7.09 24.35,7.39 23.49,8.25 IC1.1 | RC.ANODE 36.51,5.73 35.95,6.29 33.96,6.29 v33.85,6.19
  Bottom 0.152: v33.85,6.19 v33.84,6.19 v29.4,6.19
D4  (via drill 0.35)
  Top 0.152: IC1.2 23.49,7.45 23.85,7.09 23.85,6.89 25.04,5.7 28.34,5.7 v28.55,5.49 | JETSON.ANODE 36.42,3 35.3,4.12 35.3,5.34 v35.45,5.49
  Bottom 0.152: v28.55,5.49 v35.45,5.49
GND  (via drill 0.35)
  Top 0.152: IC1.5 20.89,5.05 20.55,5.39 18.95,5.39 | 18.45,3.59 18.45,4.89 18.95,5.39 | ICSP1.6 15.19,8.75 v14.75,9.19 15.45,9.89 17.45,9.89 18.65,8.69 | IC1.3 21.89,6.65 21.85,6.69 21.85,8.89 v21.75,8.99 21.65,8.99 20.85,9.79 20.85,10.49 21.25,10.89 23.75,10.89 24.1,11.24 24.1,13.57 | 24.1,13.57 24.05,13.52 19.52,13.52 18.2,14.84 IC2.14 16.48,13.57 13.94,13.57 IC2.9 | 24.1,13.57 IC2.20 26.62,13.59 32.75,13.59 32.99,13.35 32.99,12.49 | 18.65,8.69 18.65,8.54 C12.1 C3.1 18.95,6.34 18.95,5.39 | 18.65,8.69 v18.65,9.59 | 32.99,12.49 IC2.25 | 32.99,12.49 33.99,13.49 36.72,13.49 IC2.30 38.4,14.84 39.65,13.59 41.95,13.59 43.15,14.79 IC2.34 | IC2.34 44.4,13.59 46.95,13.59 | 46.95,13.59 49.55,13.59 50.77,12.37 IC2.39 52.95,12.3 v53.21,12.04 | v29.55,4.69 29.55,5.29 30.11,5.85 IC1.21 33.1,5.85 C1.1 34.27,4.01 v33.65,3.39 | 17.85,2.99 v17.85,1.89 17.1,1.89 TP3.1 | v63.05,42.59 v64.95,42.59 v64.95,40.79 v64.95,38.89 v64.95,36.99 | v63.05,42.59 v63.05,40.79 v63.05,38.89 v63.05,36.99 v63.05,35.29 | v72.95,30.89 73.98,30.89 74.86,31.77 v74.86,32.42 76,33.56 77.35,33.56 78.66,34.88 v79.21,34.88 79.86,35.53 79.86,38.55 v79.61,38.8 | v68.18,38.03 65.99,38.03 v64.95,36.99 | 17.85,2.99 17.51,3.33 v16.99,3.33 | 18.45,3.59 17.85,2.99 | X2.2 19.75,2.66 v19.08,3.33 18.71,3.33 18.45,3.59 | v24.47,2.91 v25.42,3.86 25.42,3.1 v25.99,2.52 | IC2.34 44.66,16.35 52.69,16.35 52.85,16.19 52.85,14.54 v53.14,14.24 | v63.05,42.59 v63.05,44.59 v63.05,46.69 v63.05,48.69 v65.65,48.69 v68.15,48.69 v70.85,48.69 73.25,48.69 v73.35,48.79 v76.04,48.79 v78.61,48.79 v80.85,48.79 v83.05,48.79 v83.05,45.69
  Top 0.152: v64.95,36.99 65.15,36.79 65.15,34.59 v65.45,34.29 65.45,31.49 | v35.45,2.99 34.95,2.49 34.95,2.19 35.35,1.79 v36.4,1.79 v38.05,1.79 40.75,1.79 41.2,2.24 R10.1 42.6,2.79 v42.75,2.64 | v36.1,4.49 36.35,4.49 36.7,4.84 40.45,4.84 41.25,5.64 R5.1 41.25,4.64 40.7,4.09 v40.1,4.09 | 65.45,31.49 v65.15,31.19 65,31.34 v63.8,31.34 | v6.47,7.68 6.47,9.08 v6.92,9.53 6.97,9.58 8.3,9.58 | v11.27,9.58 8.3,9.58 | v9.04,3.29 9.04,3.93 9.4,4.29 9.4,4.94 | 8.3,9.58 8.9,8.98 8.9,6.24 9.4,5.74 9.4,4.94 | v12.59,5.49 12.48,5.39 9.84,5.39 9.4,4.94 | v57.4,7.34 58.15,8.09 R24.1 | R1.1 49,5.04 50.45,5.04 | 50.45,5.04 52.35,5.04 R3.1 55.05,3.24 v55.47,3.24 | v63.25,25.54 65.45,27.74 65.45,31.49 | v54.5,11.39 52.65,9.54 v52.45,9.54 | v50.65,1.29 50.65,4.84 50.45,5.04 | v46.55,9.69 46.95,10.09 46.95,13.59 | v40.9,7.59 40.85,7.54 37.65,7.54 v37.6,7.59 36.7,7.59 36.2,8.09 36.2,9.09 v36.05,9.24 35.7,8.89 33.65,8.89 33,9.54 32.05,9.54 v32,9.49 | 63.17,5.57 63.3,5.44 63.3,0.89 v63.5,0.69 61.1,0.69 59.2,2.59 v58.81,2.59 | 63.17,5.57 63.08,5.66 v62.65,5.66 | C4.1 63.58,5.57 63.17,5.57 | 64.74,10 U9.4 65.37,9.69 v66.2,9.69 | T5.2 61.45,11.19 62.1,11.19 62.35,10.94 62.35,10.39 62.75,9.99 64.73,9.99 | C22.1 58.1,13.84 v57.35,14.59 | v66.4,12.74 66.3,12.84 66.3,13.94 65.68,14.56 U8.4 | v57.2,3.19 57.25,3.24 57.25,3.29 56.4,4.14 56.4,5.09 55.95,5.54 v55.3,5.54 | v62.55,24.74 62.55,23.19 61.99,22.63 61.99,17.12 61.94,17.07 v61.94,16.97
  Top 0.305: 64.73,9.99 64.74,10
  Bottom 0.152: C10.1 66.77,42.35 66.77,42.81 67.45,43.49 69.15,43.49 70.15,42.49 U1.2 72.35,42.49 72.55,42.29 72.55,41.69 | C7.1 66.92,32.17 66.92,33.42 C8.1 66.75,33.49 65.95,34.29 v65.45,34.29 | U1.6 72.3,40.49 72.55,40.24 | 66.73,39.44 R9.1 66.85,39.44 66.85,37.62 67.18,37.29 68.35,37.29 68.62,37.02 68.62,36.32 | v18.65,9.59 21.15,9.59 v21.75,8.99 | 4.15,2.48 SPI-LED.GND 4.3,2.48 | 4.15,2.48 2.66,2.48 0.75,4.39 0.75,7.64 | 0.75,7.64 0.75,13.09 1.25,13.59 11.38,13.59 IC2.9 | v17.85,1.89 18.95,0.79 22.35,0.79 | 22.35,0.79 30.35,0.79 31.25,1.69 31.25,2.99 v29.55,4.69 29.5,4.64 28.5,4.64 27.5,5.64 27.5,6.29 27.7,6.49 28.35,6.49 31.1,9.24 31.75,9.24 v32,9.49 | C10.1 C9.1 66.75,39.47 66.73,39.44 | 66.73,39.44 66.53,39.24 66.65,39.24 66.65,38.69 v64.95,36.99 | C11.1 68.62,36.32 | 68.62,36.32 68.67,36.37 | 68.67,36.37 68.8,36.49 | 68.8,36.49 69.75,36.49 | 69.75,36.49 U1.14 | 72.55,38.89 72.55,38.79 72.25,38.49 U1.10 69.65,38.49 69.25,38.09 69.25,36.94 68.8,36.49 | 72.55,38.89 72.55,39.4 | 72.55,39.4 72.55,39.49 | 72.55,39.49 72.55,39.99 | 72.55,39.99 72.55,40.24 | U1.7 72.55,39.99 | U1.8 72.55,39.49 | U1.9 72.45,38.99 72.55,38.89 | 72.55,41.69 72.55,40.24 | U1.15 70.25,35.99 69.75,36.49 | 68.67,36.37 69.55,35.49 U1.16 72.05,35.49 72.35,35.19 72.35,34.29 | U1.18 72.15,34.49 72.35,34.29 | 72.35,34.29 72.35,33.99 | 72.35,33.99 U1.19 | U1.21 72.25,32.99 72.35,33.09 | 72.35,33.09 72.35,33.99 | U1.23 72.25,31.99 72.31,32.05 | 72.31,32.05 72.35,32.09 72.35,33.09 | C10.1 65.2,42.34 v64.95,42.59 | v72.95,30.89 72.95,31.41 72.31,32.05 | v73.33,39.37 v73.33,41.65 72.59,41.65 72.55,41.69 | v73.33,39.37 73.29,39.4 72.55,39.4
  Bottom 0.152: v73.33,39.37 79.04,39.37 v79.61,38.8 v79.61,43.7 81.61,45.69 v83.05,45.69 | 4.3,2.48 4.35,2.48 | 4.35,2.48 5.27,2.48 v6.37,1.38 v8.46,1.38 | v8.46,1.38 9.04,1.95 v9.04,3.29 | v8.46,1.38 v10.56,1.38 | v10.56,1.38 11.27,2.09 v11.27,3.3 | v24.47,2.91 22.35,0.79 | v1.8,1.38 3.44,1.38 4.15,2.09 4.15,2.48 | v36.1,4.49 36.1,4.09 35.45,3.44 v35.45,2.99 35.05,3.39 v33.65,3.39 | v4.37,0.88 4.3,0.95 4.3,2.48 | v6.37,3.18 6.33,3.14 5.01,3.14 4.35,2.48 | v2.42,7.58 0.81,7.58 0.75,7.64 | IC4.14 56.27,8.13 56.27,8.96 v56.5,9.19 52.8,9.19 v52.45,9.54 | IC4.14 56.64,8.1 v57.4,7.34 57.65,7.09 60.4,7.09 61.56,5.93 U7.2 62.44,5.88 v62.65,5.66 | v53.21,12.04 53.86,11.39 v54.5,11.39 54.7,11.59 56.45,11.59 57.15,12.29 57.15,12.49 57.65,12.99 57.65,14.29 v57.35,14.59 | IC4.24 50.39,1.55 v50.65,1.29 | v55.3,5.54 56.25,6.49 IC4.14 | 48.95,7.34 49.1,7.49 IC4.3 | 48.3,7.34 47.9,7.34 47.8,7.44 IC4.1 46.55,9.34 v46.55,9.69 | 48.3,7.34 48.95,7.34 | IC4.2 48.44,7.48 48.3,7.34 | 48.95,7.34 49.6,7.34 | IC4.4 49.74,7.48 49.6,7.34 | v62.55,24.74 62.55,24.84 63.23,25.52 | 63.23,25.52 v63.25,25.54 | v62.5,26.14 63.12,25.52 63.23,25.52 | v10.56,1.38 11.66,1.38 v11.96,1.08 | v53.14,14.24 54.59,15.69 v59.85,15.69 61.05,15.69 | 49.6,7.34 50.2,7.34 50.4,7.54 IC4.5 50.39,9 v50.25,9.14 | v42.75,2.64 44.08,2.64 C2.1 | U10.3 65.62,10.21 66.45,11.04 66.45,12.69 v66.4,12.74 65.25,13.89 64.28,13.89 | 61.55,15.69 v61.6,15.64 | 61.55,15.69 61.6,15.69 61.6,16.63 v61.94,16.97 | 61.55,15.69 61.05,15.69 | U11.3 64.28,13.89 | 64.28,13.89 63.28,12.89 61.75,12.89 61.05,13.59 61.05,15.69 | C16.1 59.21,2.19 v58.81,2.59 | U10.3 65.68,10.21 v66.2,9.69
  Bottom 0.152: v55.47,3.24 57.15,3.24 v57.2,3.19 | C17.1 64.42,10.74 U10.3
  pour Top (rank 3): -0.9,17.54 60.75,17.54 60.75,51.49 86.4,51.49 86.4,-1.01 -0.9,-1.01
  pour Bottom (rank 3): -0.95,17.94 60.2,17.94 60.2,52.04 86.85,52.04 86.85,-1.61 -1.4,-1.61 -1.4,17.94 -1,17.94
N$2
  Bottom 0.152: R4.1 64.83,11.94 U11.1
N$3  (via drill 0.35)
  Top 0.152: IC3.3 69.56,18.44 71.9,18.44 v72.6,17.74
  Bottom 0.152: R19.1 71.5,16.74 Q1.D v72.6,17.74
N$4
  Top 0.152: IC1.20 32.2,5.05 C1.2
N$5
  Top 0.152: IC1.8 21.33,1.46 X2.3
N$6
  Top 0.152: TP1.1 R12.1
N$7  (via drill 0.35)
  Top 0.152: R3.2 52.75,3.74 v51.4,3.74
  Bottom 0.152: v51.4,3.74 51.15,3.49 51.1,3.49 51.04,3.43 IC4.23
N$8  (via drill 0.35)
  Top 0.152: v49.85,3.69 48.65,3.69 R1.2
  Bottom 0.152: IC4.25 49.74,3.58 v49.85,3.69
N$9
  Top 0.152: U9.1 71.2,7.69 R15.1
N$10
  Top 0.152: U9.5 64.85,8.94 62.6,8.94 61.3,10.24 T5.1
N$11
  Top 0.152: T5.3 61.9,12.89 62.55,12.89 62.95,13.29 U8.5
N$12
  Top 0.152: R16.1 72.72,12.37 71.55,12.37 U8.1
N$13
  Bottom 0.152: R17.1 64.73,7.89 U10.1
N$14
  Bottom 0.152: T6.1 75.1,21.39 74.3,20.59 74,20.59 73.75,20.34 73.75,9.39 73.3,8.94 U10.5
N$15
  Top 0.152: IC1.7 22.19,3.45 21.79,3.86 X2.1
N$16
  Bottom 0.152: C6.2 68.55,29.99 U1.27
N$17
  Top 0.152: R13.1 45.2,8.84 44.1,7.74 TP2.1
N$18
  Bottom 0.152: T6.3 73.2,19.49 73.3,19.39 73.3,14.49 72,13.19 U11.5
N$19
  Top 0.152: RC.CATHODE 38.22,5.79 R5.2
N$20
  Top 0.152: R10.2 38.38,2.79 JETSON.CATHODE
N$21
  Bottom 0.152: U1.26 71.13,30.44 70.2,30.44 69.9,30.74 67.6,30.74 C6.1
N$22
  Bottom 0.152: C5.1 67.6,29.14 69.7,29.14 70.05,29.49 U1.28
N$23
  Bottom 0.152: U1.29 71.06,28.87 70.34,28.87 69.81,28.34 C5.2
N$24
  Bottom 0.152: R9.2 68.7,39.69 69.45,39.69 69.65,39.89 69.65,40.49 70.15,40.99 U1.5
N$25
  Bottom 0.152: C9.2 68.5,40.99 69.45,40.99 69.95,41.49 U1.4
N$26
  Bottom 0.152: C10.2 69.6,42.34 69.95,41.99 U1.3
N$27
  Bottom 0.152: R8.1 68.65,34.99 68.85,34.99 | 68.85,34.99 U1.17 | U1.20 70.25,33.49 68.85,34.89 68.85,34.99
N$28
  Bottom 0.152: R7.1 65.25,33.34 64.75,33.84 | 64.75,33.84 62.7,33.84 62.45,33.59 62.45,27.49 63.13,26.81 D1.ANODE | R8.2 C11.2 66.35,35.74 65.15,35.74 64.2,34.79 64.2,34.39 64.75,33.84
N$31
  Bottom 0.152: C14.2 77.85,25.39 IC5.4
N$32  (via drill 0.35)
  Top 0.152: v78,24.29 78,24.49 79.65,26.14 81.25,26.14 82.5,24.89 R31.2
  Bottom 0.152: v78,24.29 78,23.19 IC5.3
N$34  (via drill 0.35)
  Top 0.152: v66.55,21.04 66.55,22.94 67.95,24.34 71.61,24.34 71.82,24.55 71.9,24.55 72.15,24.8 v72.2,24.8
  Bottom 0.152: Q2.S 67.33,19.72 66.55,18.94 65.6,18.94 65.4,19.14 65.4,20.24 66.2,21.04 v66.55,21.04 | T6.4 73.12,24.32 72.68,24.32 v72.2,24.8
N$35
  Top 0.152: TH.I/O 74.45,16.09 R21.2
N$36
  Top 0.152: ST.I/O 74.1,20.53 R20.2
N$37
  Bottom 0.152: T6.6 75.1,23.84 74.2,22.94 73.2,22.94 72.45,22.19 Q1.S
N$38
  Bottom 0.152: R25.1 68.47,3.13 U3.1
N$39
  Bottom 0.152: R11.1 69.15,22.49 68.85,22.19 67.8,22.19 67.3,21.69 67.3,20.85 Q2.G
N$40
  Bottom 0.152: R18.1 69.97,19.73 Q1.G
N$42  (via drill 0.35)
  Top 0.152: v68.04,22.94 68.7,23.59 71,23.59 71.65,22.94 71.65,22.69 70.85,21.89 70.85,20.59 70.65,20.39 69.56,20.39 IC3.6 69.51,20.34 68.21,20.34 67.55,19.68 67.55,18.84 67.98,18.41 v68.32,18.41
  Bottom 0.152: Q2.D 67.7,18.41 v68.32,18.41 | v68.04,22.94 67.7,22.59 R14.1
N$43
  Bottom 0.152: R30.1 59.97,5.86 61.22,4.61 U7.1
PCH1  (via drill 0.35)
  Top 0.152: 1.I/O 75.12,14.04 R16.2 71.85,13.14 70.35,13.14 70.2,13.29 v69.86,13.29 | IC3.2 69.43,17.67 68.12,17.67 67.9,17.89 67.3,17.89 67.15,17.74 67.15,16.69 67.65,16.19 69.05,16.19 v69.15,16.29
  Bottom 0.152: v69.15,16.29 69.15,14.3 69.86,13.59 v69.86,13.29
PCH2
  Top 0.152: 2.I/O 74.76,10.94 R15.2 72.7,10.99 69.35,10.99 68.55,11.79 68.55,14.84 68.95,15.24 71.6,15.24 71.75,15.39 71.75,16.79 72,17.04 73.09,17.04 73.3,17.24 73.3,19.34 72.92,19.72 IC3.5
PCH3  (via drill 0.35)
  Top 0.152: IC1.26 29.05,9.47 29.05,8.69 29.25,8.49 30,8.49 31,9.49 31,9.89 31.3,10.19 33.69,10.19 v34.14,9.74 | v58.25,4.49 59.85,6.09 R24.2 57.95,6.69 56.6,6.69 56.4,6.89 v55.2,6.89
  Bottom 0.152: v55.2,6.89 55.11,6.8 47.64,6.8 46.1,8.34 34.9,8.34 34.6,8.64 34.6,9.28 v34.14,9.74 | U3.3 60.8,1.14 58.95,1.14 58.25,1.84 v58.25,4.49
PCH4  (via drill 0.35)
  Top 0.152: v61.3,9.04 60.97,9.04 60.05,9.96 v60.05,10.94
  Bottom 0.152: IC4.6 51.04,9.88 51.75,10.59 54.95,10.59 55.28,10.93 60.03,10.93 v60.05,10.94 | v61.3,9.04 61.3,7.94 R17.2
PCH5
  Bottom 0.152: IC4.7 51.69,9.78 52.05,10.14 60.55,10.14 61.25,10.84 R4.2
PCH6  (via drill 0.35)
  Top 0.152: v68.15,16.99 68.15,17.07 69.48,17.07 IC3.1
  Bottom 0.152: v68.15,16.99 68.15,15.29 68.84,14.59 68.84,14.17 68.85,14.17 68.85,13.29 68.55,12.99 68.55,8.14 68.04,7.63 U7.3 68.36,6.19 R29.2
PCH_1  (via drill 0.35)
  Top 0.152: IC1.32 24.2,9.49 24.2,9.14 26.35,6.99 v29.95,6.99
  Bottom 0.152: v29.95,6.99 31.8,8.84 v32.9,8.84 34.34,7.4 36.43,7.4 36.93,6.89 43.8,6.89 46.15,4.54 56.95,4.54 R30.2
PCH_3  (via drill 0.35)
  Top 0.152: v71.35,4.14 71.35,4.64 71.95,5.24 72.35,5.24 72.95,5.84 R6.2 73.35,6.69 74.15,6.69 75.16,7.7 3.I/O
  Bottom 0.152: v71.35,4.14 71,3.79 R25.2
PH1-328  (via drill 0.35)
  Top 0.152: IC1.23 32.64,7.45 v32.8,7.29 | v43.8,3.69 45.05,4.94 45.85,4.94 47.95,7.04 51.25,7.04 55.55,11.34 56.5,11.34 57.45,12.29 T5.4
  Bottom 0.152: v43.8,3.69 42.05,3.69 41.62,3.26 37.92,3.26 37.3,3.88 37.3,5.24 35.65,6.89 33.2,6.89 v32.8,7.29
PH2_328  (via drill 0.35)
  Top 0.152: IC1.24 32.78,8.25 34.25,6.77 41.99,6.77 42.31,6.45 45.5,6.45 45.99,6.94 v46.25,6.94 | v54.75,6.14 54.55,6.34 54.55,7.49 54.8,7.74 56,7.74 57.35,9.09 57.35,9.79 57.95,10.39 T5.6
  Bottom 0.152: v50.75,5.64 50.7,5.69 | 50.7,5.69 50.4,5.99 47.8,5.99 46.85,6.94 v46.25,6.94 | v54.75,6.14 51.15,6.14 50.7,5.69
RCH1  (via drill 0.35)
  Top 0.152: IC3.4 72.33,19.07 v72.55,18.84 | R20.1 72.25,21.51 71.51,20.77 v71.51,20.62
  Bottom 0.152: v71.51,20.62 71.51,19.34 72,18.84 v72.55,18.84
RCH2
  Top 0.152: IC3.7 69.48,20.97 67.73,20.97 66.7,19.94 66.7,16.59 67.6,15.69 70.55,15.69 R21.1
SCL  (via drill 0.35)
  Top 0.152: v27.65,7.99 27.37,8.27 IC1.28 | v74.4,29.09 74.4,28.54 73.55,27.69 | 73.55,27.69 v71.3,27.69 | v44.65,7.15 46.24,8.74 46.75,8.74 47.8,9.79 47.8,10.3 48.49,10.99 v49.5,10.99 53.1,10.99 53.9,11.79 53.9,14.44 54.75,15.29 58.75,15.29 59.15,14.89 61.95,14.89 62.75,15.69 65.6,15.69 66.25,16.34 66.25,18.09 65.15,19.19 65.15,22.09 67.75,24.69 70.55,24.69 73.55,27.69 | v47.25,5.3 47.55,5 47.55,4.09 v47.15,3.69
  Bottom 0.152: IC2.5 7.59,11.25 8.05,10.79 26.55,10.79 | 26.55,10.79 27.75,9.59 27.75,8.09 v27.65,7.99 | 26.55,10.79 26.75,10.99 v49.5,10.99 | U1.13 72.55,36.99 73.85,35.69 73.85,29.59 74.35,29.09 v74.4,29.09 | v71.3,27.69 71.3,26.69 R22.1 | IC4.26 49.09,2.95 48.35,3.69 v47.15,3.69 | v47.25,5.3 47.2,5.35 46.19,5.35 44.65,6.89 v44.65,7.15
SDA  (via drill 0.35)
  Top 0.152: v22.3,10.09 23.3,9.09 23.35,9.09 25.15,7.29 v25.15,7.09 | v28.75,7.89 28.17,8.47 IC1.27 | v69.8,27.54 71.15,28.89 72.65,28.89 74.35,30.59 v75.15,30.59 | v65.75,25.39 65.75,23.29 64.7,22.24 64.7,19.14 65.55,18.29 65.55,16.69 65.15,16.29 59.15,16.29 58.95,16.09 v54.15,16.09 | v48.3,1.29 47.35,1.29 45.7,2.94 v45.7,3.94 | v42.9,4.94 43.8,5.84 46,5.84 46.9,6.74 46.9,7.64 47.3,8.04 47.95,8.04 48.55,8.64 v48.55,9.09
  Bottom 0.152: IC2.3 5.05,10.7 5.46,10.29 21.4,10.29 21.6,10.09 v22.3,10.09 | v25.15,7.09 28.05,7.09 28.75,7.79 v28.75,7.89 31.25,10.39 32.7,10.39 33,10.69 34.75,10.69 34.95,10.49 47.8,10.49 | U1.11 73.25,37.99 73.75,37.49 | 73.75,37.49 75.65,35.59 75.65,30.88 75.36,30.59 v75.15,30.59 | U1.12 73.75,37.49 | 47.8,10.49 48.28,10.49 48.9,9.87 50.33,9.87 52.35,11.89 52.35,15.19 53.25,16.09 v54.15,16.09 | v69.8,27.54 68.58,27.54 67.2,27.54 66.65,26.99 66.65,25.24 65.8,24.39 65.43,24.39 R23.1 65.13,24.78 v65.75,25.39 | IC4.27 48.44,1.43 v48.3,1.29 | v45.7,3.94 45.35,3.59 45.15,3.59 44.41,4.34 44.37,4.34 43.77,4.94 v42.9,4.94 | v48.55,9.09 48.55,9.19 47.8,9.94 47.8,10.49
VCC_R  (via drill 0.35)
  Top 0.152: v64.75,17.14 64.73,17.12 IC3.16 | R31.1 82.45,23.09 82.45,21.64 82.1,21.29 81,21.29 80.62,21.67 80.78,21.82 | C21.2 80.55,22.04 80.78,21.82 | 80.78,21.82 81.25,22.29 81.4,22.29 v81.65,22.04 | v69.2,5.04 69.2,6.09 C19.2
  Bottom 0.152: v64.75,17.14 66.35,17.14 67.05,16.44 67.05,5.14 67.59,4.61 U7.4 68.48,5.04 v69.2,5.04
  Bottom 0.254: 64.05,21.69 64.05,21.74 67.01,24.7 67.01,25.85 67.35,26.19 67.85,26.19 68.45,25.59 68.45,25.49 68.75,25.19 71.5,25.19 71.7,25.39
  Bottom 0.305: 64.05,21.69 64.05,17.84 v64.75,17.14 64.75,16.69 C20.2 | IC5.1 80.8,23.04 | 80.8,23.04 81.1,23.04 81.5,23.44 81.5,25.84 80.6,26.74 80.6,32.74 79.9,33.44 79.1,33.44 75.7,30.04 75.7,25.79 75.4,25.49 71.8,25.49 71.7,25.39 | IC5.1 79.95,22.84 | D2.C 79.75,22.04 IC5.1 | 80.8,23.04 81.65,22.19 v81.65,22.04
VCC_RC  (via drill 0.35)
  Top 0.152: 3.VCC 77.67,8.17 77.67,11.37 2.VCC 1.VCC 77.72,16.61 | TH.VCC 77.72,16.82 77.72,16.61 | v72.7,15.07 73.73,15.07 74.05,15.39 76.5,15.39 77.72,16.61
  Bottom 0.152: v72.7,15.07 72.48,15.29 71.25,15.29 R19.2 70.05,16.49 70.05,17.94 69.1,18.89 68.92,18.89 68.75,19.07 67.7,19.07 67.28,18.65 66.89,18.65 66.54,18.29 65.6,18.29 64.81,19.08 64.81,21.05 R14.2
  Bottom 0.254: 77.65,19.52 ST.VCC
  Bottom 0.305: ST.VCC 77.69,16.85 TH.VCC | D2.A 77.65,19.52
  pour Top (no thermals): 76.45,20.54 78.9,20.54 78.9,6.89 76.45,6.89
VCC_RC1  (via drill 0.35)
  Top 0.152: v79.4,6.45 79.86,5.99 81.4,5.99 82.95,7.54 82.95,19.74 83.73,20.53 83.73,25.81 82.4,27.14 78.4,27.14 77.45,28.09 v77.45,28.94
  Bottom 0.152: C23.2 72.58,11.92 U11.6 70.7,12.37 69.33,12.37 68.95,11.99 68.95,8.99 70.27,7.67 U10.6 72.58,7.67 C18.2 72.9,7.89 74.2,6.59 79.26,6.59 v79.4,6.45 | R18.2 70.95,22.24 71.65,22.24 72.15,22.74 | R11.2 71.25,22.74 72.15,22.74 | 72.15,22.74 72.4,22.74 73,23.34 73.55,23.34 74.15,23.94 T6.5 74.15,25.09 75.95,25.09 76.8,25.94 76.8,26.59 77.35,27.14 78.25,27.14 | C24.2 79.65,30.29 78.15,30.29 77.45,29.59 v77.45,28.94 77.45,27.94 78.25,27.14 | IC5.5 79.75,27.14 | 79.75,27.14 C15.2 | 78.25,27.14 79.75,27.14

### Text on the board
tPlace: JETSON | RC | #612 | Designed in Aizu | REV 2.0.9
bPlace: F-612-2-9-A-N-J-0-P
tDocu: OLED AREA | RX | TX | GND